# Altium project DHO800_BatteryPack_USB_C_V1.1.PrjPcb
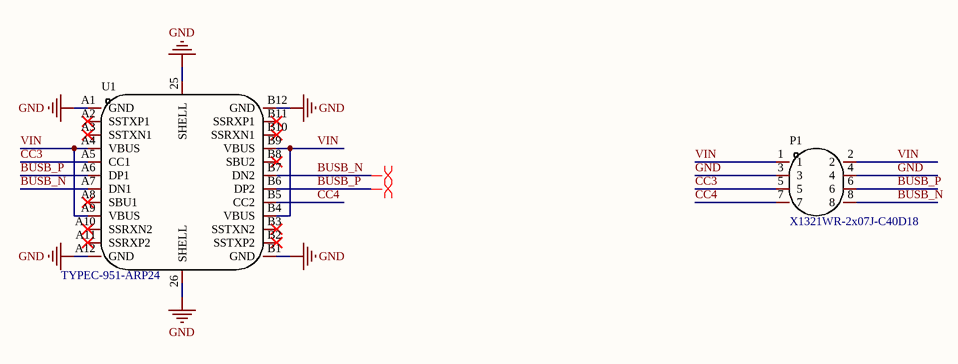
[diagram p0: SCH.SchDoc]
1 sheet, 2 parts. Net scope: global (net labels, ports and power ports of the same name join across sheets).
Board file: PCB.PcbDoc

## Sheet SCH.SchDoc
size A4; SheetNumber: 1; SheetTotal: 1

### Parts
P1  X1321WR-2x07J-C40D18  [HDR-TH_8P-P1.27-L]
U1  TYPEC-951-ARP24  [USB-C-SMD_TYPEC-951-ARP24]

### Nets
GND: P1.3 P1.4 U1.25(SHELL) U1.26(SHELL) U1.A1(GND) U1.A12(GND) U1.B1(GND) U1.B12(GND)
BUSB_N: P1.8 U1.A7(DN1) U1.B7(DN2)
BUSB_P: P1.6 U1.A6(DP1) U1.B6(DP2)
CC3: P1.5 U1.A5(CC1)
CC4: P1.7 U1.B5(CC2)
VIN: P1.1 P1.2 U1.A4(VBUS) U1.A9(VBUS) U1.B4(VBUS) U1.B9(VBUS)

Not connected (* = marked no-connect by the designer): U1 A2(SSTXP1)* A3(SSTXN1)* A8(SBU1)* A10(SSRXN2)* A11(SSRXP2)* B2(SSTXP2)* B3(SSTXN2)* B8(SBU2)* B10(SSRXN1)* B11(SSRXP1)*

### Layout directives
differential pair: BUSB_N, BUSB_P

### Library data of the parts
P1 = 双排插针: 双排弯针2*4P; Manufacturer: XKB Connectivity(中国星坤); Add into BOM: yes; Pitch: 1.27mm; Pin Structure: 2x7P; Circluar Pins/Square Pins: 方针; Current Rating (Max): 1A; Voltage Rating (Max): 250V; Welding Temperature (Max): 260℃; Name: X1321WR-2x07J-C40D18; Symbol: X1321WR-2X07J-C40D18; Device: X1321WR-2x07J-C40D18; LCSC Part Name: 1.27mm 2x7P 弯插 方针; Supplier Part: C2881827; Manufacturer Part: X1321WR-2x07J-C40D18; Supplier Footprint: 插件,P=1.27mm; JLCPCB Part Class: Extended Part; Supplier: LCSC; Convert to PCB: yes; Number of Pins: 14; Number of Rows: 2; Row Spacing: 1.27mm; Mounting Type: 弯插; Length of Mating Pin: 4mm; Insulation Height: 1mm; Length of End Connection Pin: -; Contact Material: 黄铜; Contact Plating: 金; Operating Temperature Range: -40℃~+105℃
U1 = TYPEC-951-ARP24: USB C公头; Manufacturer: XUNPU(讯普); Add into BOM: yes; Connector Type: Type-C; Gender: 公头; Number of Contacts: 24; Number of Ports: 1; Current Rating - Power (Max): 3A; Welding Temperature (Max): 260℃; Name: TYPEC-951-ARP24; Symbol: TYPEC-951-ARP24; Device: TYPEC-951-ARP24; LCSC Part Name: Type-C 公头 卧贴; Supplier Part: C2856663; Manufacturer Part: TYPEC-951-ARP24; Supplier Footprint: SMD,13.75x8.25x2.40mm; JLCPCB Part Class: Extended Part; Datasheet: 2022-06-27/563699A/5b3ef206478045388967090afecc516d/C2856663_TYPE-C公头卧贴_2021-07-23.PDF; Supplier: LCSC; Convert to PCB: yes; Standard: USB 3.1; Mounting Style: 卧贴; Operating Temperature Range: -45℃~+85℃